# EasyEDA schematic ProjektWzmacniacza_EasyEda.json
TITLE: Wzmacniacz klasy D; REV: 1.0; Date: 2025-05-20; Sheet: 1/1; Drawn By: Jakub Obara
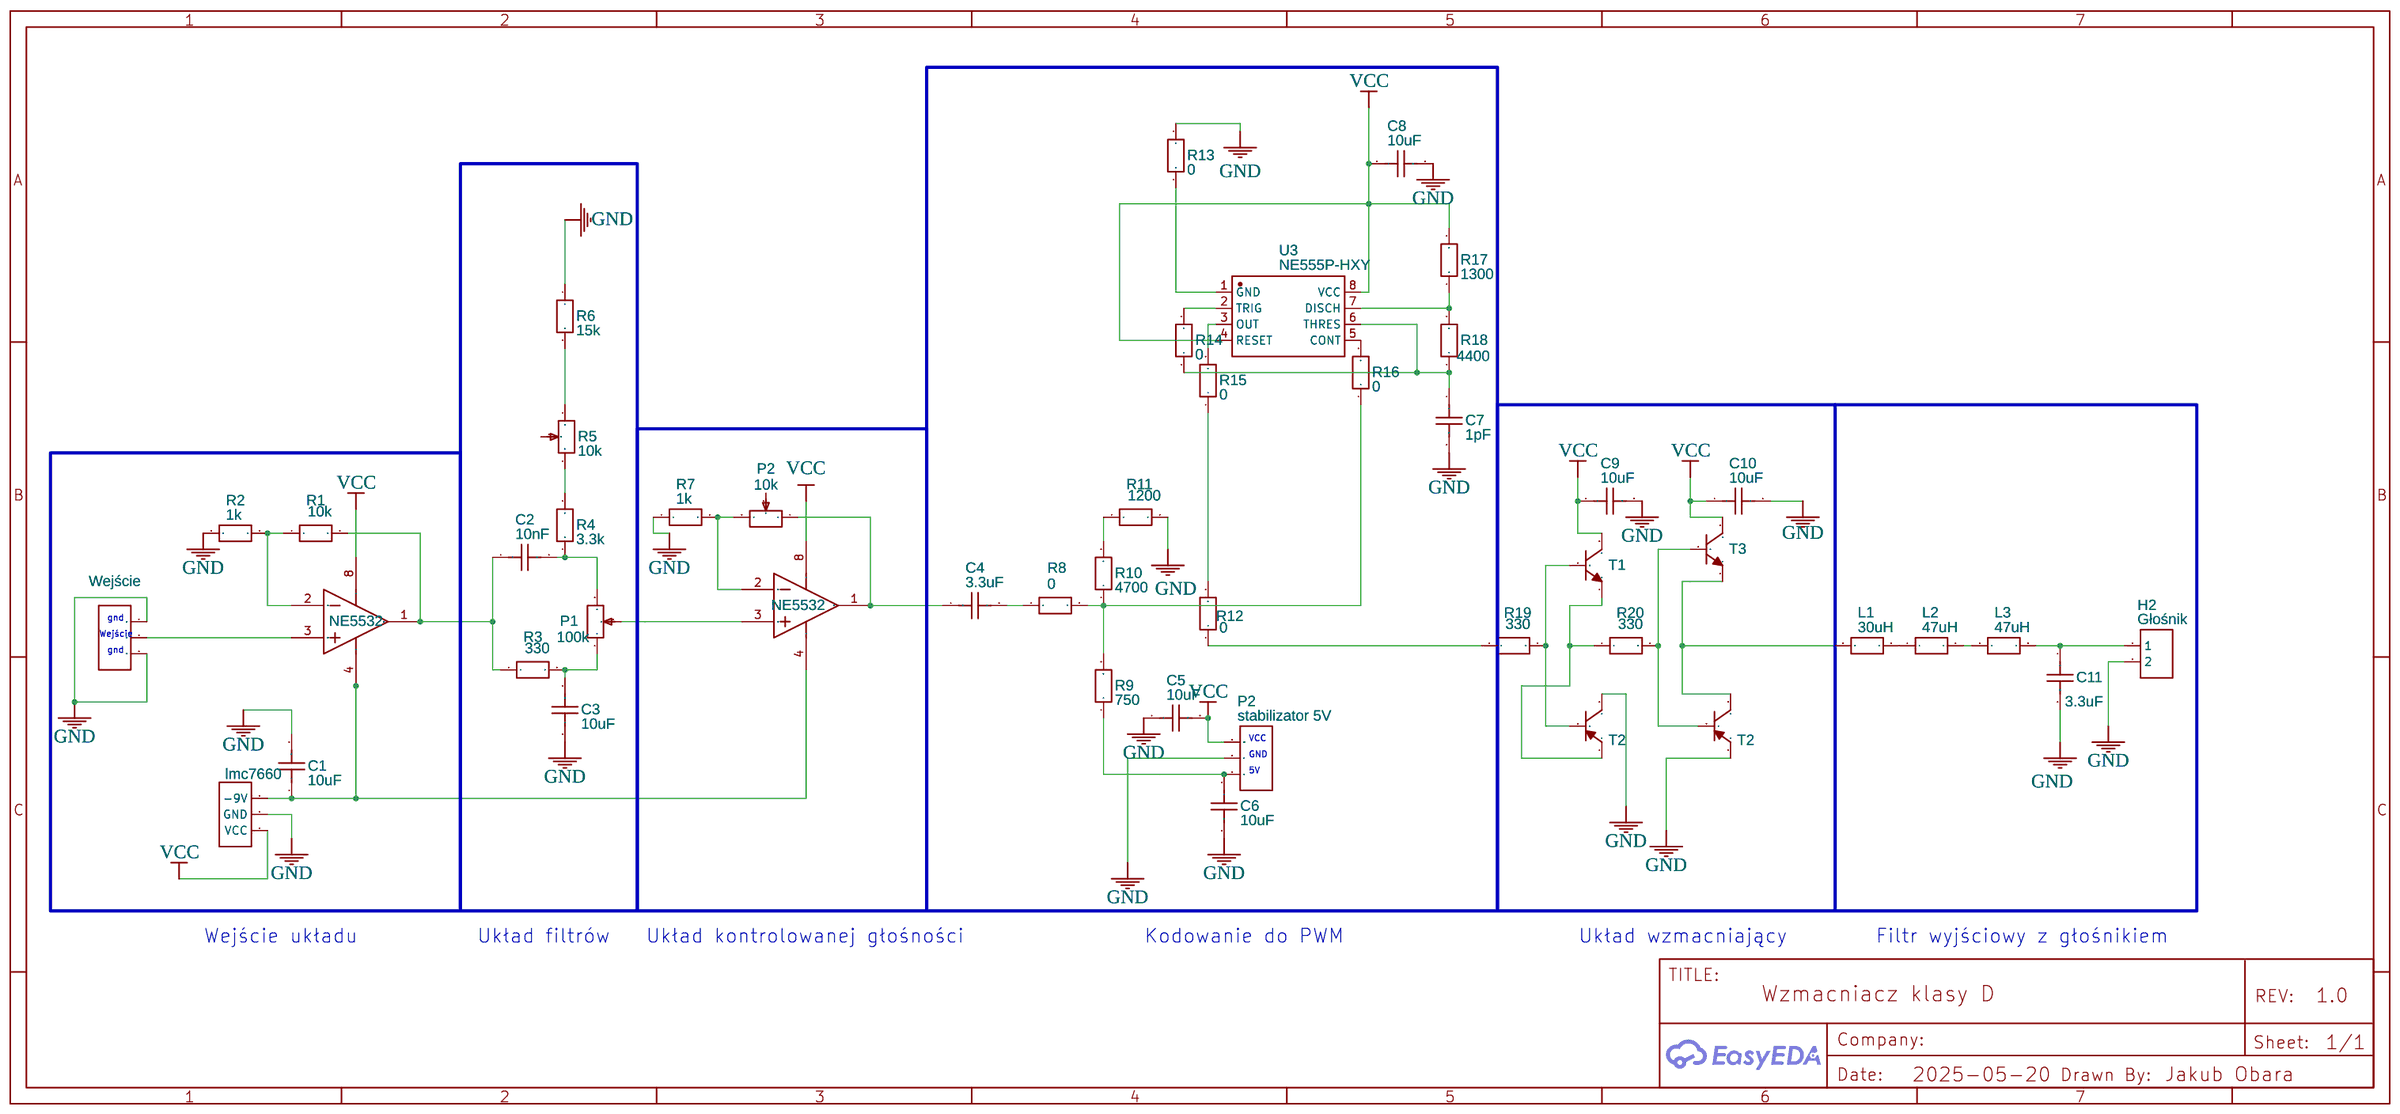
[diagram p0: schematic sheet]

## Parts
C1  10uF  [CONDENSATORE-12.25*31-F27]
C2  10nF  [CONDENSATORE-12.25*31-F27]
C3  10uF  [CONDENSATORE-12.25*31-F27]
C4  3.3uF  [CONDENSATORE-12.25*31-F27]
C5  10uF  [CONDENSATORE-12.25*31-F27]
C6  10uF  [CONDENSATORE-12.25*31-F27]
C7  1pF  [CONDENSATORE-12.25*31-F27]
C8  10uF  [CONDENSATORE-12.25*31-F27]
C9  10uF  [CONDENSATORE-12.25*31-F27]
C10  10uF  [CONDENSATORE-12.25*31-F27]
C11  3.3uF  [CONDENSATORE-12.25*31-F27]
H2  Głośnik  [HDR-F-2.54_1X2]
L1  30uH  [R_AXIAL-0.3]
L2  47uH  [R_AXIAL-0.3]
L3  47uH  [R_AXIAL-0.3]
P1  100k  [RES-ADJ-TH_3296W]
P2  stabilizator 5V  [CONN-TH_3P-P5.08]
P2#2  10k  [RES-ADJ-TH_3296W]
P3  Wejście  [CONN-TH_3P-P5.08]
P4  lmc7660  [CONN-TH_3P-P5.08]
R1  10k  [RES-TH_BD2.5-L6.8-P10.00-D0.6]
R2  1k  [RES-TH_BD2.5-L6.8-P10.00-D0.6]
R3  330  [RES-TH_BD2.5-L6.8-P10.00-D0.6]
R4  3.3k  [RES-TH_BD2.5-L6.8-P10.00-D0.6]
R5  10k  [RES-ADJ-TH_3296W]
R6  15k  [RES-TH_BD2.5-L6.8-P10.00-D0.6]
R7  1k  [RES-TH_BD2.5-L6.8-P10.00-D0.6]
R8  0  [RES-TH_BD2.5-L6.8-P10.00-D0.6]
R9  750  [RES-TH_BD2.5-L6.8-P10.00-D0.6]
R10  4700  [RES-TH_BD2.5-L6.8-P10.00-D0.6]
R11  1200  [RES-TH_BD2.5-L6.8-P10.00-D0.6]
R12  0  [RES-TH_BD2.5-L6.8-P10.00-D0.6]
R13  0  [RES-TH_BD2.5-L6.8-P10.00-D0.6]
R14  0  [RES-TH_BD2.5-L6.8-P10.00-D0.6]
R15  0  [RES-TH_BD2.5-L6.8-P10.00-D0.6]
R16  0  [RES-TH_BD2.5-L6.8-P10.00-D0.6]
R17  1300  [RES-TH_BD2.5-L6.8-P10.00-D0.6]
R18  4400  [RES-TH_BD2.5-L6.8-P10.00-D0.6]
R19  330  [RES-TH_BD2.5-L6.8-P10.00-D0.6]
R20  330  [RES-TH_BD2.5-L6.8-P10.00-D0.6]
T1  2N3904(SOT-23)  [SOT-23-3_L2.9-W1.3-P1.90-LS2.4-TR]
T2  T2  [SOT-23-3_L2.9-W1.6-P1.90-LS2.8-TR-CW]
T3  2N3904(SOT-23)  [SOT-23-3_L2.9-W1.3-P1.90-LS2.4-TR]
T4  T2  [SOT-23-3_L2.9-W1.6-P1.90-LS2.8-TR-CW]
U1  NE5532  [PDIP-8_L9.6-W6.4-P2.54-LS7.6-BL]  (section 1)
U2  NE5532  [PDIP-8_L9.6-W6.4-P2.54-LS7.6-BL]  (section 1)
U3  NE555P-HXY  [PDIP-8_L9.6-W6.4-P2.54-LS7.6-BL]

## Library data of the parts
C1-C11 = CONDENSATORE-12.25*31-F27: Supplier Part: C29321; Supplier: LCSC; Manufacturer: ReliaPro; Manufacturer Part: 1uf/250V/CBBCapacitor; image: http://image.lceda.cn/szlcsc/C29321.jpg
H2 = HDR-F-2.54_1x2: Supplier Part: C49661; Supplier: LCSC; Contributor: LCEDA_Lib
L1-L3 = R_AXIAL-0.3_EU: Contributor: LCEDA_Lib
P1 P2#2 R5 = Precision potentiometer 3296W/50ohm: Supplier Part: C21881; Supplier: LCSC; Manufacturer: ReliaPro; JLCPCB Part Class: Extended Part
P2-P4 = CONN-TH_3P-P5.08: Supplier: LCSC; Contributor: LCEDA_Lib
R1-R4 R6-R20 = MMFR2568B1K00V9: Supplier: LCSC; Supplier Part: C7603280; Manufacturer: RESI(开步睿思); JLCPCB Part Class: Extended Part; Contributor: lcsc
T1 T3 = 2N3904(SOT-23): Supplier: LCSC; Manufacturer: KEC; Manufacturer Part: 2n3904S-RTK/PS; Supplier Part: C18536; Paste Type: SOT-23; Contributor: LCEDA_Lib
T2 T4 = 2N3906(SOT-23): Supplier: LCSC; Manufacturer: KEC; Manufacturer Part: 2N3906S-RTK/PS; Contributor: LCEDA_Lib; Supplier Part: C147294
U1 U2 = NE5532AP: Supplier: LCSC; Supplier Part: C353150; Manufacturer: TI(德州仪器); JLCPCB Part Class: Extended Part; subpart_no: 1
U3 = NE555P-HXY: Supplier: LCSC; Supplier Part: C20616346; Manufacturer: HXY MOSFET(华轩阳电子); JLCPCB Part Class: Extended Part; Contributor: lcsc

## Nets
GND: C1.2 C3.2 C5.1 C6.2 C7.2 C8.2 C9.2 C10.2 C11.2 H2.2 P2.2 P3.1(gnd) P3.3(gnd) P4.2(GND) R2.1 R6.1 R7.1 R11.2 R13.2 T2.3(C) T4.1(E)
VCC: C5.2 C8.1 C9.1 C10.1 P2.1(VCC) P4.1(VCC) R17.2 T1.3(C) T3.3(C) U1.8(V+) U2.8(V+) U3.4(RESET) U3.8(VCC)
Net-(C1-1): C1.1 P4.3(-9V) U1.4(V-) U2.4(V-)
Net-(C2-1): C2.1 R1.2 R3.1 U1.1(OUT A)
Net-(C2-2): C2.2 P1.3 R4.1
Net-(C3-1): C3.1 P1.1 R3.2
Net-(C4-1): C4.1 P2#2.1 U2.1(OUT A)
Net-(C4-2): C4.2 R8.1
Net-(C6-1): C6.1 P2.3 R9.1
Net-(C7-1): C7.1 R14.1 R18.1 U3.6(THRES)
Net-(C11-1): C11.1 H2.1 L3.2
Net-(L1-1): L1.1 T3.1(E) T4.3(C)
Net-(L1-2): L1.2 L2.1
Net-(L2-2): L2.2 L3.1
Net-(P1-2): P1.2 U2.3(IN A+)
Net-(P2#2-3): P2#2.3 R7.2 U2.2(IN A-)
Net-(P3-2): P3.2(sygnał) U1.3(IN A+)
Net-(R1-1): R1.1 R2.2 U1.2(IN A-)
Net-(R4-2): R4.2 R5.3
Net-(R5-1): R5.1 R6.2
Net-(R8-2): R8.2 R9.2 R10.1 R16.1
Net-(R10-2): R10.2 R11.1
Net-(R12-1): R12.1 R19.1
Net-(R12-2): R12.2 R15.1
Net-(R13-1): R13.1 U3.1(GND)
Net-(R14-2): R14.2 U3.2(TRIG)
Net-(R15-2): R15.2 U3.3(OUT)
Net-(R16-2): R16.2 U3.5(CONT)
Net-(R17-1): R17.1 R18.2 U3.7(DISCH)
Net-(R19-2): R19.2 T1.2(B) T2.2(B)
Net-(R20-1): R20.1 T1.1(E) T2.1(E)
Net-(R20-2): R20.2 T3.2(B) T4.2(B)

Not connected (* = marked no-connect by the designer): P2#2 2; R5 2

## Notes on the sheet
- gnd
- Wejście
- gnd
- VCC
- GND
- 5V
- Wejście układu
- Układ filtrów
- Układ kontrolowanej głośności
- Kodowanie do PWM
- Układ wzmacniający
- Filtr wyjściowy z głośnikiem
